# Altium schematic sheet AVR-TAG.SchDoc
size A4; Organization: Altium Limited; Address1: L3, 12a Rodborough Rd; Address2: Frenchs Forest; Address3: NSW; Address4: Australia 2086
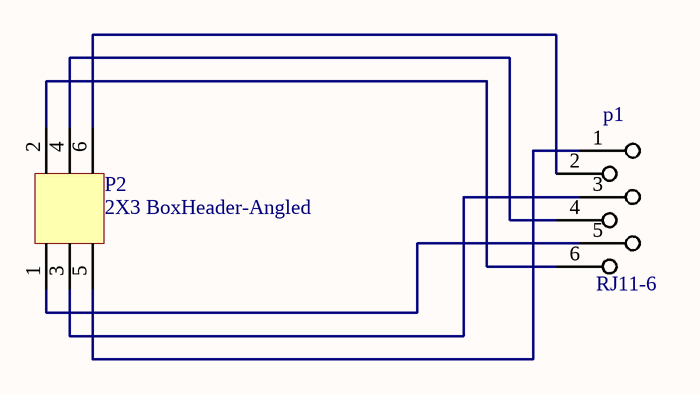
[diagram p0: AVR-TAG.SchDoc]

## Parts
p1  RJ11-6  [RJ11-6pin]
P2  2X3 BoxHeader-Angled  [2X3 box header-angled]

## Nets
Netp1_1: p1.1 P2.5
Netp1_2: p1.2 P2.6
Netp1_3: p1.3 P2.3
Netp1_4: p1.4 P2.4
Netp1_5: p1.5 P2.1
Netp1_6: p1.6 P2.2

## Notes on the sheet
- Title
- Size:
- Date:
- A4
- Number:
- Time:
- Revision:
- Sheet
- of
- File: